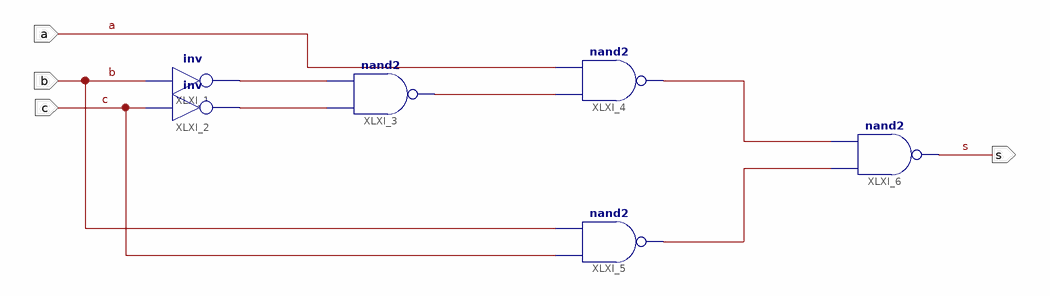
[diagram p0: schematic sheet 1]
// Xilinx ISE schematic circuit1.sch (spartan3e) as structural Verilog: 6 symbols, 4 ports
module circuit1 (
  input  b,
  input  c,
  input  a,
  output s
);

  wire XLXN_1, XLXN_2, XLXN_3, XLXN_4, XLXN_5;

  not XLXI_1 (XLXN_1, b);
  not XLXI_2 (XLXN_2, c);
  nand XLXI_3 (XLXN_3, XLXN_2, XLXN_1);
  nand XLXI_4 (XLXN_4, XLXN_3, a);
  nand XLXI_5 (XLXN_5, c, b);
  nand XLXI_6 (s, XLXN_5, XLXN_4);
endmodule
